# Altium schematic sheet Keyboard.SchDoc
size 420 x 297 mm
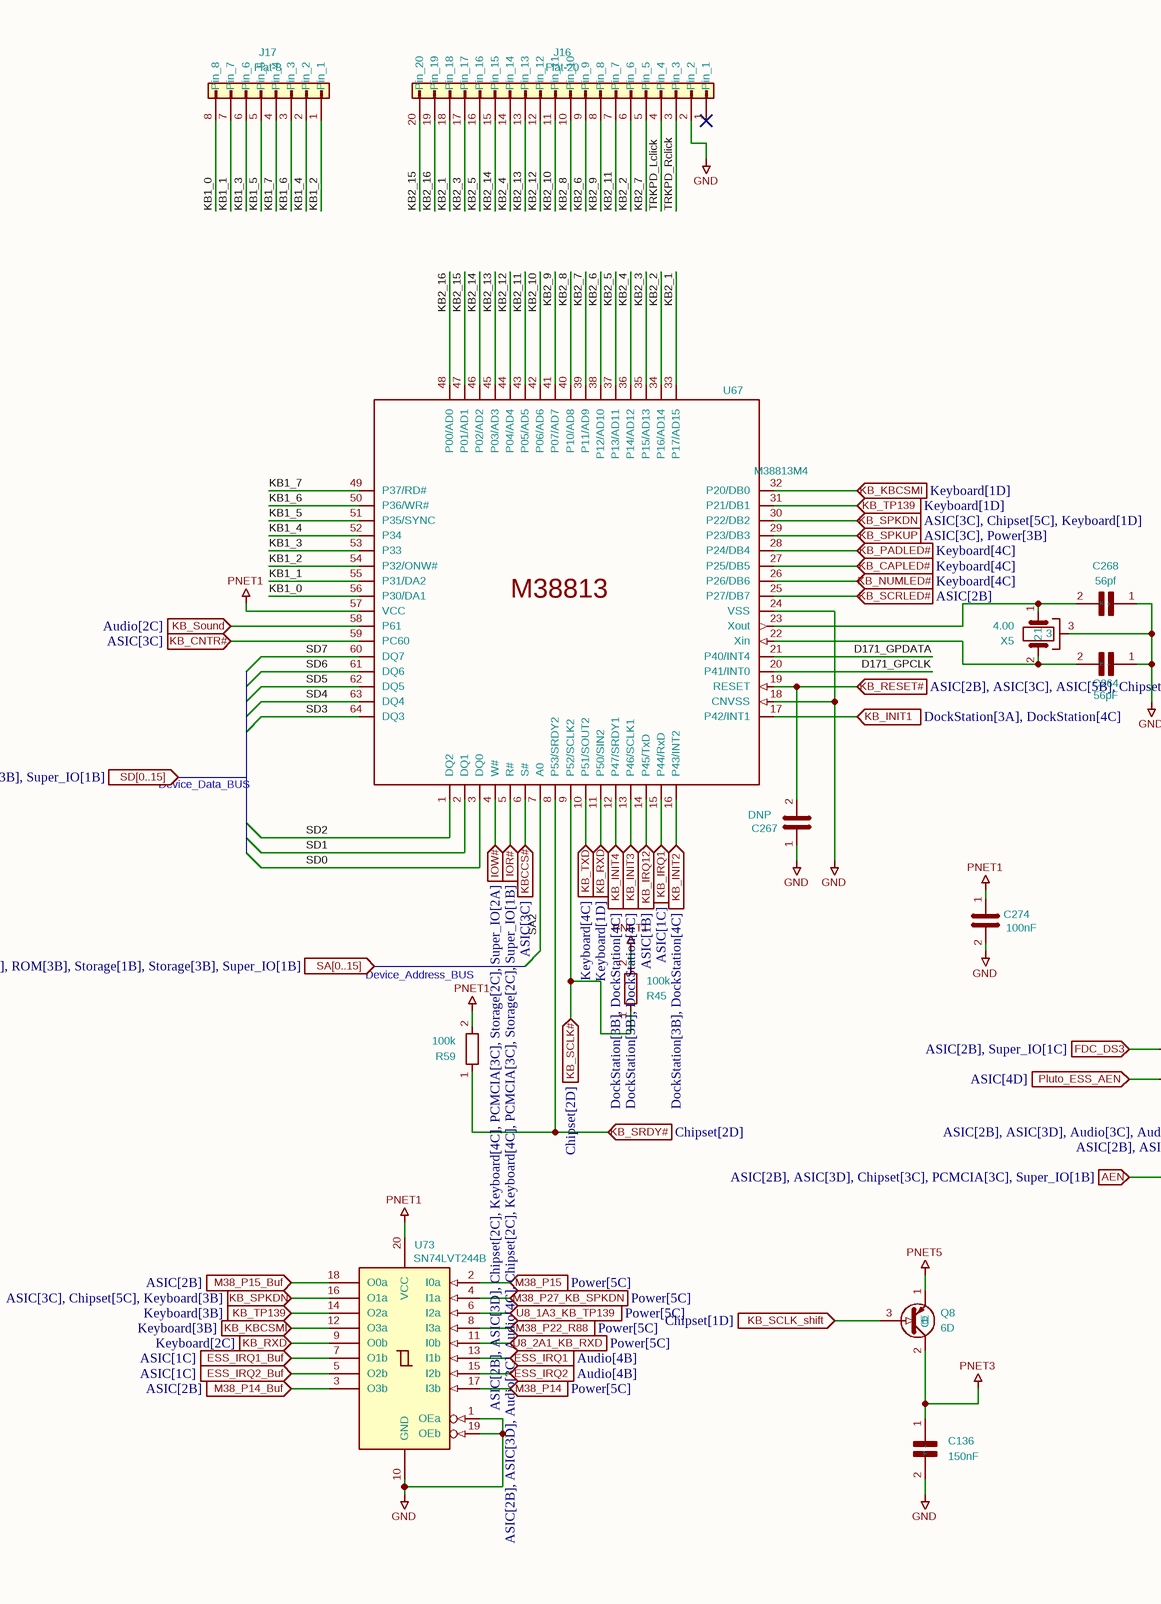
[diagram p0: Keyboard.SchDoc, left]
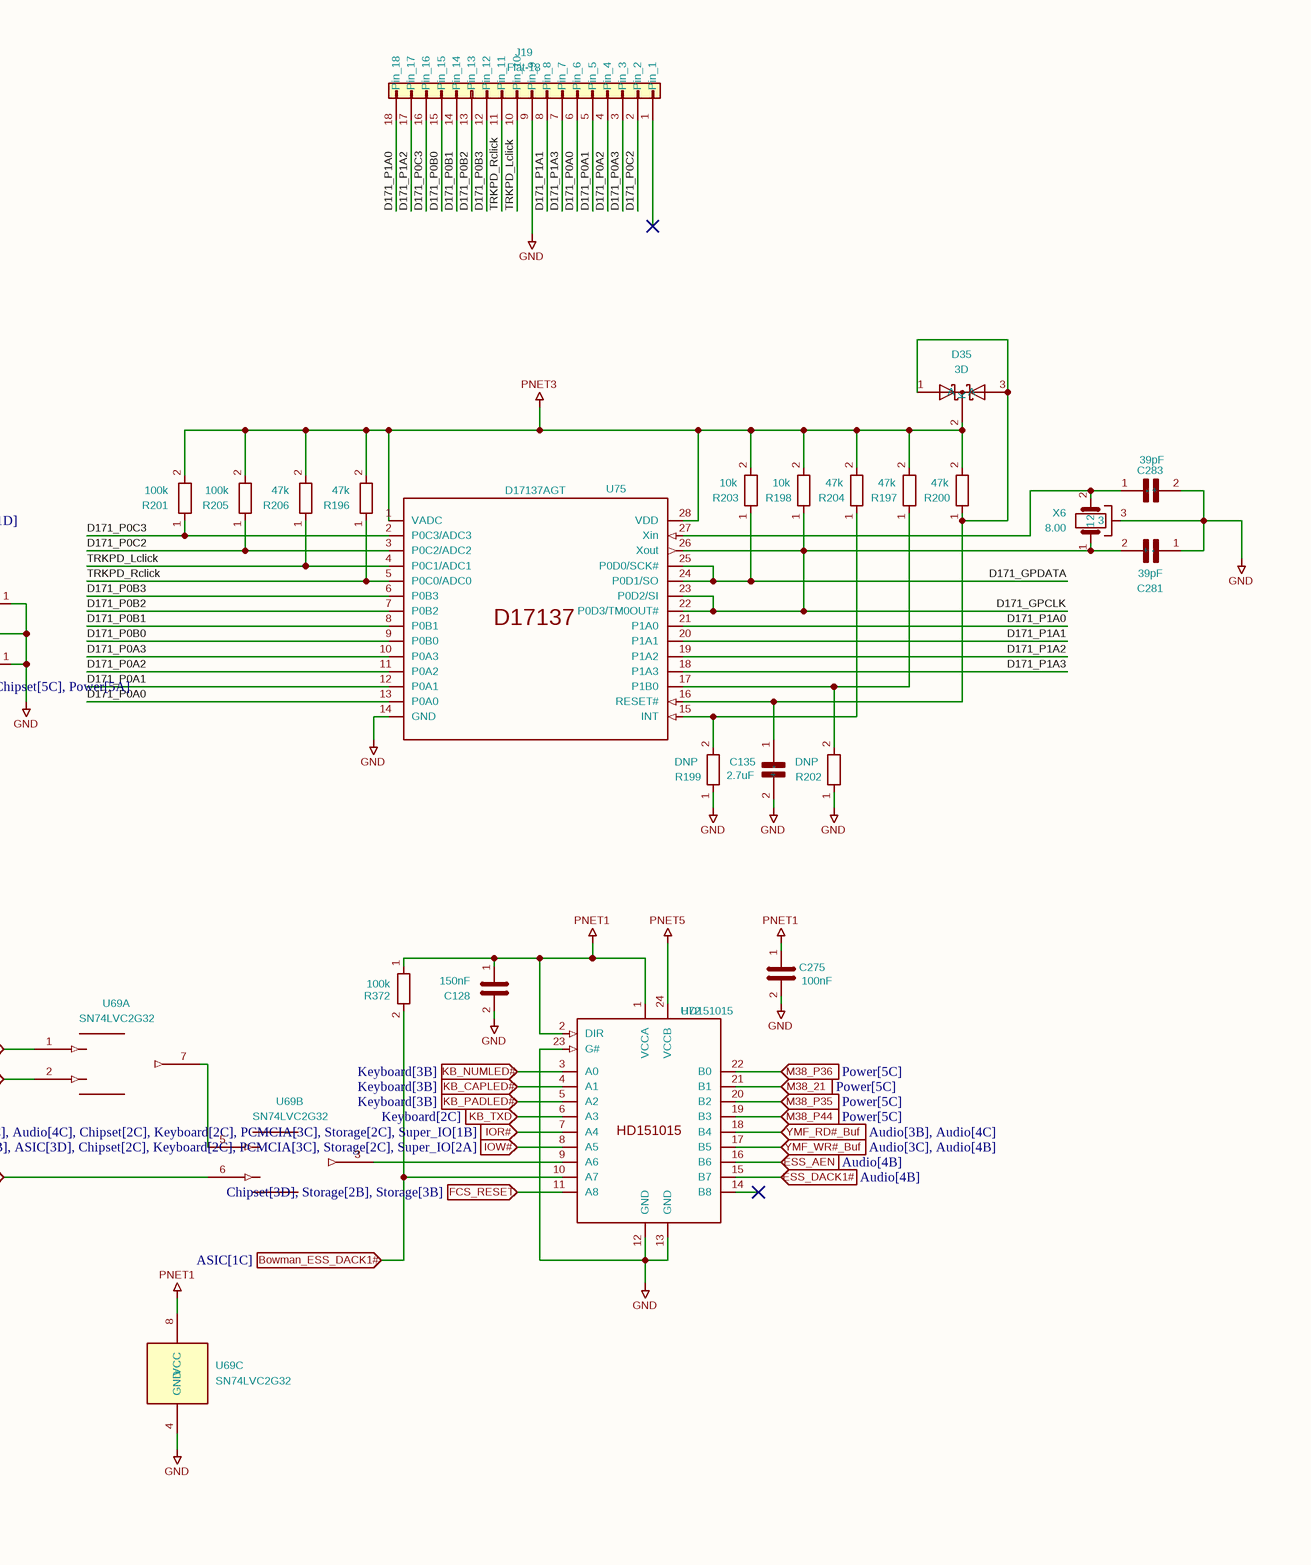
[diagram p1: Keyboard.SchDoc, right]

## Parts
C128  150nF  [C_0402_1005Metric]
C135  2.7uF  [C_0805_2012Metric]
C136  150nF  [C_0402_1005Metric]
C264  56pF  [C_0402_1005Metric]
C267  DNP  [C_0402_1005Metric]
C268  56pf  [C_0402_1005Metric]
C274  100nF  [C_0402_1005Metric]
C275  100nF  [C_0402_1005Metric]
C281  39pF  [C_0402_1005Metric]
C283  39pF  [C_0402_1005Metric]
D35  3D  [3D]
J16  Flat-20  [Flat-20]
J17  Flat-8  [Flat-8]
J19  Flat-18  [Flat-18]
Q8  6D  [3D]
R45  100k  [R_0402_1005Metric]
R59  100k  [R_0402_1005Metric]
R196  47k  [R_0402_1005Metric]
R197  47k  [R_0402_1005Metric]
R198  10k  [R_0402_1005Metric]
R199  DNP  [R_0402_1005Metric]
R200  47k  [R_0402_1005Metric]
R201  100k  [R_0402_1005Metric]
R202  DNP  [R_0402_1005Metric]
R203  10k  [R_0402_1005Metric]
R204  47k  [R_0402_1005Metric]
R205  100k  [R_0402_1005Metric]
R206  47k  [R_0402_1005Metric]
R372  100k  [R_0402_1005Metric]
U67  M38813M4  [QFN64]
U69  SN74LVC2G32  [SSOP-8_2.95x2.8mm_P0.65mm]  (parts A,B,C of 3)
U72  HD151015  [SSOP-24_5.3x8.2mm_P0.65mm]
U73  SN74LVT244B  [TSSOP-20_4.4x6.5mm_P0.65mm]
U75  D17137AGT  [SSOP-28]
X5  4.00  [XTAL-5]
X6  8.00  [XTAL-4]

## Ports
AEN (in, see ASIC[2B], ASIC[3D], Chipset[3C], PCMCIA[3C], Super_IO[1B]), Bowman_ESS_DACK1# (in, see ASIC[1C]), ESS_AEN (in, see Audio[4B]), ESS_DACK1# (in, see Audio[4B]), ESS_IRQ1 (in, see Audio[4B]), ESS_IRQ1_Buf (in, see ASIC[1C]), ESS_IRQ2 (in, see Audio[4B]), ESS_IRQ2_Buf (in, see ASIC[1C]), FCS_RESET (in, see Chipset[3D], Storage[2B], Storage[3B]), FDC_DS3 (in, see ASIC[2B], Super_IO[1C]), IOR# (in, see ASIC[2B], ASIC[3D], Audio[3C], Audio[4C], Chipset[2C], Keyboard[2C], PCMCIA[3C], Storage[2C], Super_IO[1B]), IOR# (in, see ASIC[2B], ASIC[3D], Audio[3C], Audio[4C], Chipset[2C], Keyboard[4C], PCMCIA[3C], Storage[2C], Super_IO[1B]), IOW# (in, see ASIC[2B], ASIC[3D], Chipset[2C], Keyboard[2C], PCMCIA[3C], Storage[2C], Super_IO[2A]), IOW# (in, see ASIC[2B], ASIC[3D], Chipset[2C], Keyboard[4C], PCMCIA[3C], Storage[2C], Super_IO[2A]), KB_CAPLED# (in, see Keyboard[3B]), KB_CAPLED# (in, see Keyboard[4C]), KB_CNTR# (in, see ASIC[3C]), KB_INIT1 (in, see DockStation[3A], DockStation[4C]), KB_INIT2 (in, see DockStation[3B], DockStation[4C]), KB_INIT3 (in, see DockStation[3B], DockStation[4C]), KB_INIT4 (in, see DockStation[3B], DockStation[4C]), KB_IRQ1 (in, see ASIC[1C]), KB_IRQ12 (in, see ASIC[1B]), KB_KBCSMI (in, see Keyboard[1D]), KB_KBCSMI (in, see Keyboard[3B]), KB_NUMLED# (in, see Keyboard[3B]), KB_NUMLED# (in, see Keyboard[4C]), KB_PADLED# (in, see Keyboard[3B]), KB_PADLED# (in, see Keyboard[4C]), KB_RESET# (in, see ASIC[2B], ASIC[3C], ASIC[5B], Chipset[5C], Power[5A]), KB_RXD (in, see Keyboard[1D]), KB_RXD (in, see Keyboard[2C]), KB_SCLK# (in, see Chipset[2D]), KB_SCLK_shift (in, see Chipset[1D]), KB_SCRLED# (in, see ASIC[2B]), KB_Sound (in, see Audio[2C]), KB_SPKDN (in, see ASIC[3C], Chipset[5C], Keyboard[1D]), KB_SPKDN (in, see ASIC[3C], Chipset[5C], Keyboard[3B]), KB_SPKUP (in, see ASIC[3C], Power[3B]), KB_SRDY# (in, see Chipset[2D]), KB_TP139 (in, see Keyboard[1D]), KB_TP139 (in, see Keyboard[3B]), KB_TXD (in, see Keyboard[2C]), KB_TXD (in, see Keyboard[4C]), KBCCS# (in, see ASIC[3C]), M38_21 (in, see Power[5C]), M38_P14 (in, see Power[5C]), M38_P14_Buf (in, see ASIC[2B]), M38_P15 (in, see Power[5C]), M38_P15_Buf (in, see ASIC[2B]), M38_P22_R88 (in, see Power[5C]), M38_P27_KB_SPKDN (in, see Power[5C]), M38_P35 (in, see Power[5C]), M38_P36 (in, see Power[5C]), M38_P44 (in, see Power[5C]), Pluto_ESS_AEN (in, see ASIC[4D]), SA[0..15] (in, see ASIC[1B], ASIC[3D], Audio[4B], Chipset[2D], Chipset[6B], PCMCIA[2B], ROM[1B], ROM[3B], Storage[1B], Storage[3B], Super_IO[1B]), SD[0..15] (in, see ASIC[1B], ASIC[3C], Audio[3B], Chipset[2B], PCMCIA[2C], ROM[3B], ROM[5C], Storage[1B], Storage[1C], Storage[3B], Super_IO[1B]), U8_1A3_KB_TP139 (in, see Power[5C]), U8_2A1_KB_RXD (in, see Power[5C]), YMF_RD#_Buf (in, see Audio[3B], Audio[4C]), YMF_WR#_Buf (in, see Audio[3C], Audio[4B])

## Nets
GND: C128.2 C135.2(-) C136.2(-) C264.1(+) C267.1 C268.1(+) C274.2 C275.2 C281.1(+) C283.2(-) J16.2(Pin_2) J19.9(Pin_9) R199.1 R202.1 U67.18(CNVSS) U67.24(VSS) U69.4(GND) U72.12(GND) U72.13(GND) U72.23(G#) U73.1(OEa) U73.10(GND) U73.19(OEb) U75.14(GND) X5.3 X6.3
PNET1: C128.1 C274.1 C275.1 R45.2 R59.2 R372.1 U67.57(VCC) U69.8(VCC) U72.1(VCCA) U72.2(DIR) U73.20(VCC)
PNET3: C136.1(+) D35.2(K) Q8.2(C) R196.2 R197.2 R198.2 R200.2 R201.2 R203.2 R204.2 R205.2 R206.2 U75.1(VADC) U75.28(VDD)
PNET5: Q8.1(E) U72.24(VCCB)
AEN: U69.6 ; port AEN
Bowman_ESS_DACK1#: R372.2 U72.10(A7) ; port Bowman_ESS_DACK1#
D171_GPCLK: C281.2(-) R198.1 U67.20(P41/INT0) U75.22(P0D3/TM0OUT#) U75.23(P0D2/SI) U75.26(Xout) X6.1
D171_GPDATA: R203.1 U67.21(P40/INT4) U75.24(P0D1/SO) U75.25(P0D0/SCK#)
D171_P0A0: J19.6(Pin_6) U75.13(P0A0)
D171_P0A1: J19.5(Pin_5) U75.12(P0A1)
D171_P0A2: J19.4(Pin_4) U75.11(P0A2)
D171_P0A3: J19.3(Pin_3) U75.10(P0A3)
D171_P0B0: J19.15(Pin_15) U75.9(P0B0)
D171_P0B1: J19.14(Pin_14) U75.8(P0B1)
D171_P0B2: J19.13(Pin_13) U75.7(P0B2)
D171_P0B3: J19.12(Pin_12) U75.6(P0B3)
D171_P0C2: J19.2(Pin_2) R205.1 U75.3(P0C2/ADC2)
D171_P0C3: J19.16(Pin_16) R201.1 U75.2(P0C3/ADC3)
D171_P1A0: J19.18(Pin_18) U75.21(P1A0)
D171_P1A1: J19.8(Pin_8) U75.20(P1A1)
D171_P1A2: J19.17(Pin_17) U75.19(P1A2)
D171_P1A3: J19.7(Pin_7) U75.18(P1A3)
ESS_AEN: U72.16(B6) ; port ESS_AEN
ESS_DACK1#: U72.15(B7) ; port ESS_DACK1#
ESS_IRQ1: U73.13(I1b) ; port ESS_IRQ1
ESS_IRQ1_Buf: U73.7(O1b) ; port ESS_IRQ1_Buf
ESS_IRQ2: U73.15(I2b) ; port ESS_IRQ2
ESS_IRQ2_Buf: U73.5(O2b) ; port ESS_IRQ2_Buf
FCS_RESET: U72.11(A8) ; port FCS_RESET
FDC_DS3: U69.1 ; port FDC_DS3
IOR#: U67.5(R#) U72.7(A4) ; port IOR#
IOW#: U67.4(W#) U72.8(A5) ; port IOW#
KB1_0: J17.8(Pin_8) U67.56(P30/DA1)
KB1_1: J17.7(Pin_7) U67.55(P31/DA2)
KB1_2: J17.1(Pin_1) U67.54(P32/ONW#)
KB1_3: J17.6(Pin_6) U67.53(P33)
KB1_4: J17.2(Pin_2) U67.52(P34)
KB1_5: J17.5(Pin_5) U67.51(P35/SYNC)
KB1_6: J17.3(Pin_3) U67.50(P36/WR#)
KB1_7: J17.4(Pin_4) U67.49(P37/RD#)
KB2_1: J16.18(Pin_18) U67.33(P17/AD15)
KB2_2: J16.6(Pin_6) U67.34(P16/AD14)
KB2_3: J16.17(Pin_17) U67.35(P15/AD13)
KB2_4: J16.14(Pin_14) U67.36(P14/AD12)
KB2_5: J16.16(Pin_16) U67.37(P13/AD11)
KB2_6: J16.9(Pin_9) U67.38(P12/AD10)
KB2_7: J16.5(Pin_5) U67.39(P11/AD9)
KB2_8: J16.10(Pin_10) U67.40(P10/AD8)
KB2_9: J16.8(Pin_8) U67.41(P07/AD7)
KB2_10: J16.11(Pin_11) U67.42(P06/AD6)
KB2_11: J16.7(Pin_7) U67.43(P05/AD5)
KB2_12: J16.12(Pin_12) U67.44(P04/AD4)
KB2_13: J16.13(Pin_13) U67.45(P03/AD3)
KB2_14: J16.15(Pin_15) U67.46(P02/AD2)
KB2_15: J16.20(Pin_20) U67.47(P01/AD1)
KB2_16: J16.19(Pin_19) U67.48(P00/AD0)
KB_CAPLED#: U67.27(P25/DB5) U72.4(A1) ; port KB_CAPLED#
KB_CNTR#: U67.59(PC60) ; port KB_CNTR#
KB_INIT1: U67.17(P42/INT1) ; port KB_INIT1
KB_INIT2: U67.16(P43/INT2) ; port KB_INIT2
KB_INIT3: U67.13(P46/SCLK1) ; port KB_INIT3
KB_INIT4: U67.12(P47/SRDY1) ; port KB_INIT4
KB_IRQ1: U67.15(P44/RxD) ; port KB_IRQ1
KB_IRQ12: U67.14(P45/TxD) ; port KB_IRQ12
KB_KBCSMI: U67.32(P20/DB0) U73.12(O3a) ; port KB_KBCSMI
KB_NUMLED#: U67.26(P26/DB6) U72.3(A0) ; port KB_NUMLED#
KB_PADLED#: U67.28(P24/DB4) U72.5(A2) ; port KB_PADLED#
KB_RESET#: C267.2 U67.19(RESET) ; port KB_RESET#
KB_RXD: U67.11(P50/SIN2) U73.9(O0b) ; port KB_RXD
KB_SCLK#: R45.1 U67.9(P52/SCLK2) ; port KB_SCLK#
KB_SCLK_shift: Q8.3(B) ; port KB_SCLK_shift
KB_SCRLED#: U67.25(P27/DB7) ; port KB_SCRLED#
KB_Sound: U67.58(P61) ; port KB_Sound
KB_SPKDN: U67.30(P22/DB2) U73.16(O1a) ; port KB_SPKDN
KB_SPKUP: U67.29(P23/DB3) ; port KB_SPKUP
KB_SRDY#: R59.1 U67.8(P53/SRDY2) ; port KB_SRDY#
KB_TP139: U67.31(P21/DB1) U73.14(O2a) ; port KB_TP139
KB_TXD: U67.10(P51/SOUT2) U72.6(A3) ; port KB_TXD
KBCCS#: U67.6(S#) ; port KBCCS#
M38_21: U72.21(B1) ; port M38_21
M38_P14: U73.17(I3b) ; port M38_P14
M38_P14_Buf: U73.3(O3b) ; port M38_P14_Buf
M38_P15: U73.2(I0a) ; port M38_P15
M38_P15_Buf: U73.18(O0a) ; port M38_P15_Buf
M38_P22_R88: U73.8(I3a) ; port M38_P22_R88
M38_P27_KB_SPKDN: U73.4(I1a) ; port M38_P27_KB_SPKDN
M38_P35: U72.20(B2) ; port M38_P35
M38_P36: U72.22(B0) ; port M38_P36
M38_P44: U72.19(B3) ; port M38_P44
Pluto_ESS_AEN: U69.2 ; port Pluto_ESS_AEN
SA2: U67.7(A0)
SD0: U67.3(DQ0)
SD1: U67.2(DQ1)
SD2: U67.1(DQ2)
SD3: U67.64(DQ3)
SD4: U67.63(DQ4)
SD5: U67.62(DQ5)
SD6: U67.61(DQ6)
SD7: U67.60(DQ7)
TRKPD_Lclick: J16.4(Pin_4) J19.10(Pin_10) R206.1 U75.4(P0C1/ADC1)
TRKPD_Rclick: J16.3(Pin_3) J19.11(Pin_11) R196.1 U75.5(P0C0/ADC0)
U8_1A3_KB_TP139: U73.6(I2a) ; port U8_1A3_KB_TP139
U8_2A1_KB_RXD: U73.11(I0b) ; port U8_2A1_KB_RXD
YMF_RD#_Buf: U72.18(B4) ; port YMF_RD#_Buf
YMF_WR#_Buf: U72.17(B5) ; port YMF_WR#_Buf
NetC135_1: C135.1(+) D35.1(A) D35.3(A) R200.1 U75.16(RESET#)
NetC264_2: C264.2(-) U67.22(Xin) X5.2
NetC268_2: C268.2(-) U67.23(Xout) X5.1
NetC283_1: C283.1(+) U75.27(Xin) X6.2
NetR197_1: R197.1 R202.2 U75.17(P1B0)
NetR199_2: R199.2 R204.1 U75.15(INT)
NetU69_3: U69.3 U72.9(A6)
NetU69_5: U69.5 U69.7

Not connected (* = marked no-connect by the designer): J16 1(Pin_1)*; J19 1(Pin_1)*; U72 14(B8)*

## Notes on the sheet
- Device_Data_BUS
- (near R59) Device_Address_BUS
- 1
- 2
- 3
- 4
- 5
- 6
- 7
- 8
- A
- B
- C
- D
- E
- Title: PC110
- File: Keyboard.kicad_sch
- Sheet: /
- Recreated by: Ahmad Byagowi
- F
- KiCad E.D.A.  kicad (5.1.4)-1
- Size: A3
- Date:
- Rev:
- Id: 1/1

## Library data of the parts
C128 C135 C136 C264 C267 C268 C274 C275 C281 C283 = C
  C128 C136: Value: 150nF; Footprint: Capacitor_SMD:C_0402_1005Metric
  C135: Value: 2.7uF; Footprint: Capacitor_SMD:C_0805_2012Metric
  C264: Value: 56pF; Footprint: Capacitor_SMD:C_0402_1005Metric
  C267: Value: DNP; Footprint: Capacitor_SMD:C_0402_1005Metric
  C268: Value: 56pf; Footprint: Capacitor_SMD:C_0402_1005Metric
  C274 C275: Value: 100nF; Footprint: Capacitor_SMD:C_0402_1005Metric
  C281 C283: Value: 39pF; Footprint: Capacitor_SMD:C_0402_1005Metric
D35 = D_Schottky_Dual_CommonCathode_AKA: Value: 3D; Footprint: PC110:3D
J16 = Conn_01x20: Value: Flat-20; Footprint: PC110:Flat-20
J17 = Conn_01x08: Value: Flat-8; Footprint: PC110:Flat-8
J19 = Conn_01x18: Value: Flat-18; Footprint: PC110:Flat-18
Q8 = Q_PNP_Generic_ECB: Value: 6D; Footprint: PC110:3D
R45 R59 R196-R206 R372 = R
  R45 R59 R201 R205: Value: 100k; Footprint: PCM_Resistor_SMD_AKL:R_0402_1005Metric
  R196 R197 R200 R204 R206: Value: 47k; Footprint: PCM_Resistor_SMD_AKL:R_0402_1005Metric
  R198 R203: Value: 10k; Footprint: PCM_Resistor_SMD_AKL:R_0402_1005Metric
  R199 R202: Value: DNP; Footprint: PCM_Resistor_SMD_AKL:R_0402_1005Metric
  R372: Value: 100k; Footprint: Resistor_SMD:R_0402_1005Metric
U67 = M38813: Value: M38813M4; Footprint: PC110:QFN64
U69 = 74LVC2G32: Value: SN74LVC2G32; Footprint: Package_SO:SSOP-8_2.95x2.8mm_P0.65mm
U73 = 74LS244: Value: SN74LVT244B; Footprint: Package_SO:TSSOP-20_4.4x6.5mm_P0.65mm
U75 = D17137: Value: D17137AGT; Footprint: PC110:SSOP-28
X5 X6 = Crystal_GND3
  X5: Value: 4.00; Footprint: PC110:XTAL-5
  X6: Value: 8.00; Footprint: PC110:XTAL-4
U72 = HD151015: Value: HD151015; Footprint: Package_SO:SSOP-24_5.3x8.2mm_P0.65mm